# Altium project PCB_Design.PrjPcb
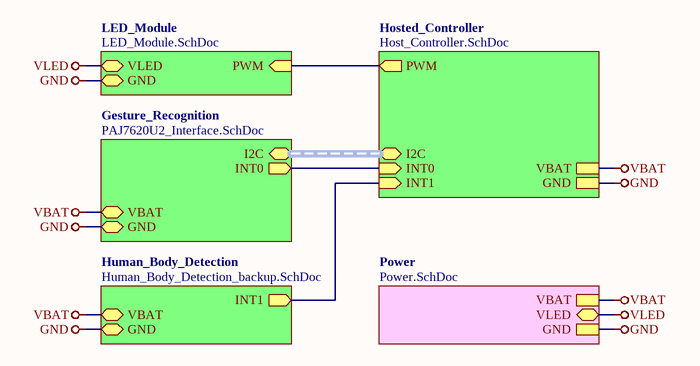
[diagram p0: Main.SchDoc]
12 sheets, 32 parts. Net scope: hierarchical (ports join the sheet entries above them; power ports are global).
Board files: test.PcbDoc, Board.PcbDoc, PCB_of_Aultimation.PcbDoc, PCB1.PcbDoc
Sheets:
  Main.SchDoc
    Power = Power.SchDoc
    Hosted_Controller = Host_Controller.SchDoc
      Oscillator = Oscillator_11.0592MHz_Using_HC49S.SchDoc
      Reset = Reset_With_Power_On.SchDoc
      Microcontroller_STC12C5A60S2 = Microcontroller_STC12C5A60S2.SchDoc
    LED_Module = LED_Module.SchDoc
      Amplifier = IRF530N_MOS_Amplifier.SchDoc
      LED = LED_Port.SchDoc
    Gesture_Recognition = PAJ7620U2_Interface.SchDoc
    Human_Body_Detection = Human_Body_Detection_backup.SchDoc
      Level_Switch = Level_Switch_by_9013.SchDoc

## Sheet Main.SchDoc: Main
size A4

### Sub-sheets
Gesture_Recognition = PAJ7620U2_Interface.SchDoc: VBAT, GND, INT0 (out), I2C (harness I2C)
Hosted_Controller = Host_Controller.SchDoc: VBAT, GND, PWM (out), I2C (harness I2C), INT0 (in), INT1 (in)
Human_Body_Detection = Human_Body_Detection_backup.SchDoc: INT1 (out), VBAT, GND
LED_Module = LED_Module.SchDoc: PWM (in), VLED, GND
Power = Power.SchDoc: VBAT, GND, VLED

### Nets
GND: sheet Power/GND, sheet Hosted_Controller/GND, sheet LED_Module/GND, sheet Gesture_Recognition/GND, sheet Human_Body_Detection/GND
PWM: sheet Hosted_Controller/PWM, sheet LED_Module/PWM
VBAT: sheet Power/VBAT, sheet Power/VLED, sheet Hosted_Controller/VBAT, sheet LED_Module/VLED, sheet Gesture_Recognition/VBAT, sheet Human_Body_Detection/VBAT  [also labelled VLED]  [project net PWM_VCC]
INT0: sheet Hosted_Controller/INT0, sheet Gesture_Recognition/INT0
INT1: sheet Hosted_Controller/INT1, sheet Human_Body_Detection/INT1

### Buses and harness runs
harness sheet Gesture_Recognition/I2C = sheet Hosted_Controller/I2C

## Sheet Power.SchDoc: Power
size A4
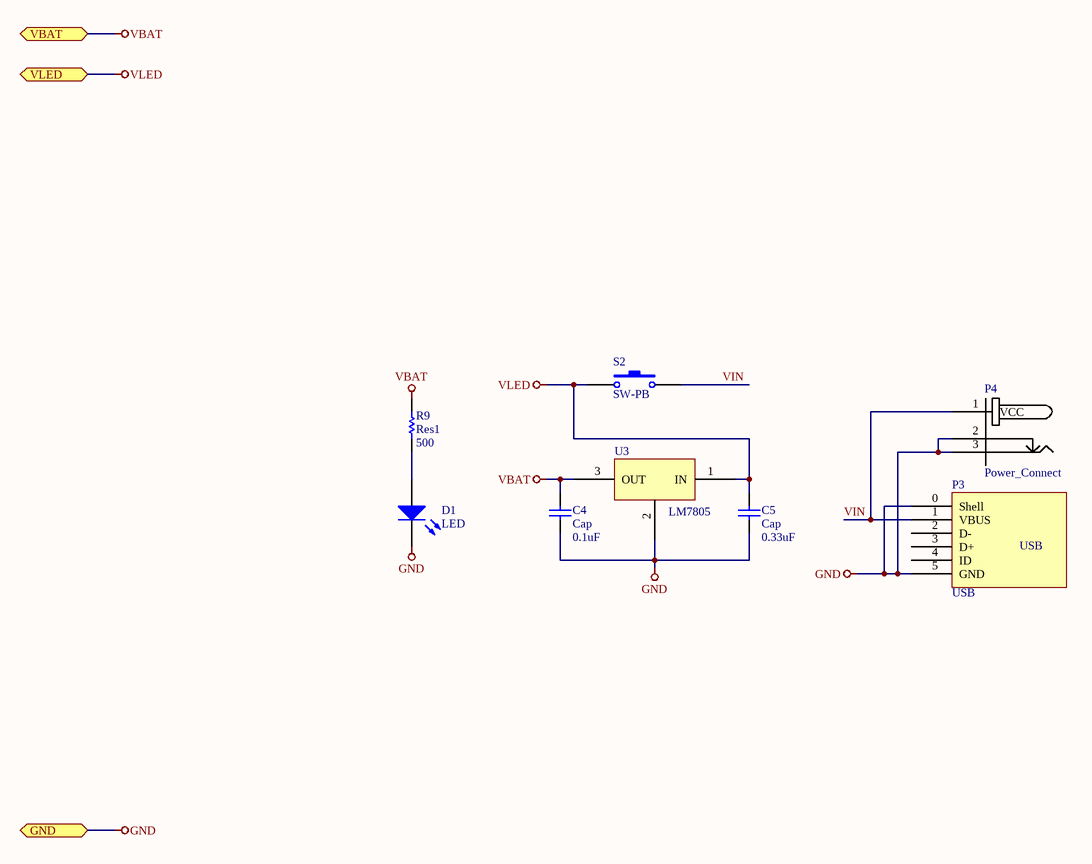
[diagram p1: Power.SchDoc]

### Parts
C4  Cap  value 0.1uF  [C0805]
C5  Cap  value 0.33uF  [C0805]
D1  LED  [L0805R]
P3  USB  [USB-MINI]
P4  Power_Connect  [DC_002]
R9  Res1  value 500  [R0805]
S2  SW-PB  [SW7X7]
U3  LM7805  [TO-263]

### Ports
GND, VBAT, VLED

### Nets
GND: C4.1 C5.1 D1.2(K) P3.0(Shell) P3.5(GND) P4.2(TAP) P4.3(GND) U3.2(GND) ; port GND
VBAT: C4.2 C5.2 R9.2 S2.1 U3.1(IN) U3.3(OUT) ; port VBAT, port VLED  [also labelled VLED]  [project net PWM_VCC]
VIN: P3.1(VBUS) P4.1(VCC) S2.2
NetD1_1: D1.1(A) R9.1

Not connected (* = marked no-connect by the designer): P3 2(D-) 3(D+) 4(ID)

### Library data of the parts
C4 C5 = Cap: Non-Polar Capacitor
D1 = LED: Typical INFRARED GaAs LED; Published: 8-Jun-2000; LatestRevisionDate: 08-Jul-2005; LatestRevisionNote: Mech Layer 1 removed.; PackageReference: LED-0; Publisher: Altium Limited; PackageDescription: LED; 2 Leads
P3 = USBPort
P4 = Power: pin to pad: 1>2 2>3 3>1
R9 = Res1: Resistor
S2 = SW-PB: Switch

## Sheet Host_Controller.SchDoc: Host_Controller
size A4
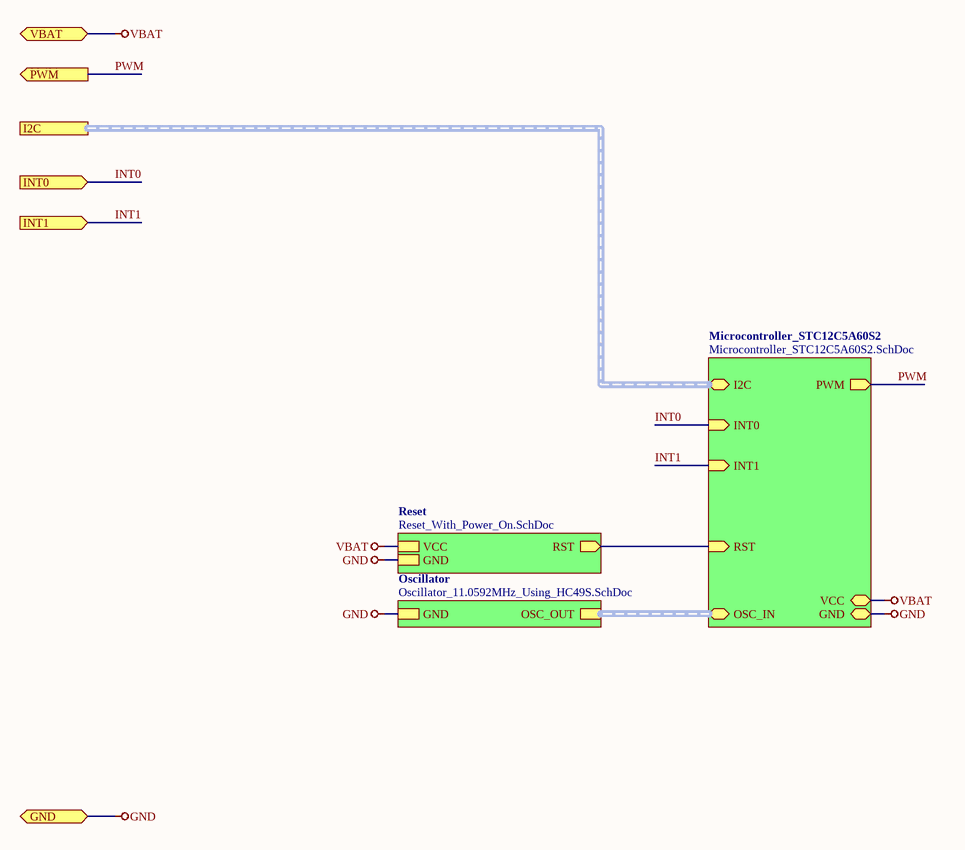
[diagram p2: Host_Controller.SchDoc]

### Sub-sheets
Microcontroller_STC12C5A60S2 = Microcontroller_STC12C5A60S2.SchDoc: OSC_IN (harness CLOCK), RST (in), VCC, GND, PWM (out), I2C (harness I2C), INT0 (in), INT1 (in)
Oscillator = Oscillator_11.0592MHz_Using_HC49S.SchDoc: GND, OSC_OUT (harness OSC)
Reset = Reset_With_Power_On.SchDoc: VCC, GND, RST (out)

### Ports
GND, I2C (harness I2C), INT0 (in), INT1 (in), PWM (out), VBAT

### Nets
GND: port GND, sheet Oscillator/GND, sheet Reset/GND, sheet Microcontroller_STC12C5A60S2/GND
PWM: port PWM, sheet Microcontroller_STC12C5A60S2/PWM
VBAT: port VBAT, sheet Reset/VCC, sheet Microcontroller_STC12C5A60S2/VCC  [project net PWM_VCC]
INT0: port INT0, sheet Microcontroller_STC12C5A60S2/INT0
INT1: port INT1, sheet Microcontroller_STC12C5A60S2/INT1
RST: sheet Reset/RST, sheet Microcontroller_STC12C5A60S2/RST

### Buses and harness runs
harness port I2C = sheet Microcontroller_STC12C5A60S2/I2C
harness sheet Microcontroller_STC12C5A60S2/OSC_IN = sheet Oscillator/OSC_OUT

## Sheet Oscillator_11.0592MHz_Using_HC49S.SchDoc: Oscillator_11.0592MHz_Using_HC49S
size A4
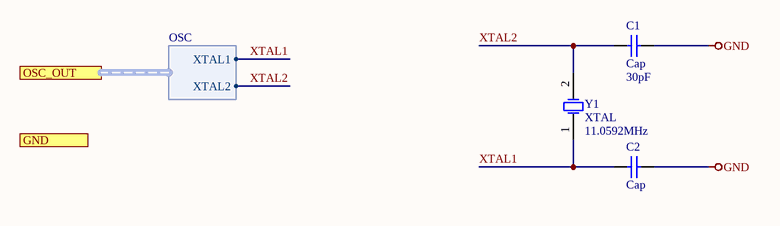
[diagram p3: Oscillator_11.0592MHz_Using_HC49S.SchDoc]

### Parts
C1  Cap  value 30pF  [C0805]
C2  Cap  [C0805]
Y1  XTAL  OscillationFrequency: 11.0592MHz  [XTAL-HC49S-SMD]

### Ports
GND, OSC_OUT (harness OSC)

### Harnesses
OSC: XTAL1, XTAL2

### Nets
GND: C1.2 C2.2 ; port GND
XTAL1: C2.1 Y1.1(OSC1) ; port OSC_OUT.XTAL1
XTAL2: C1.1 Y1.2(OSC2) ; port OSC_OUT.XTAL2

### Library data of the parts
C1 C2 = Cap: Non-Polar Capacitor
Y1 = XTAL_1: Crystal Oscillator

## Sheet Reset_With_Power_On.SchDoc: Reset_With_Power_On
size A4
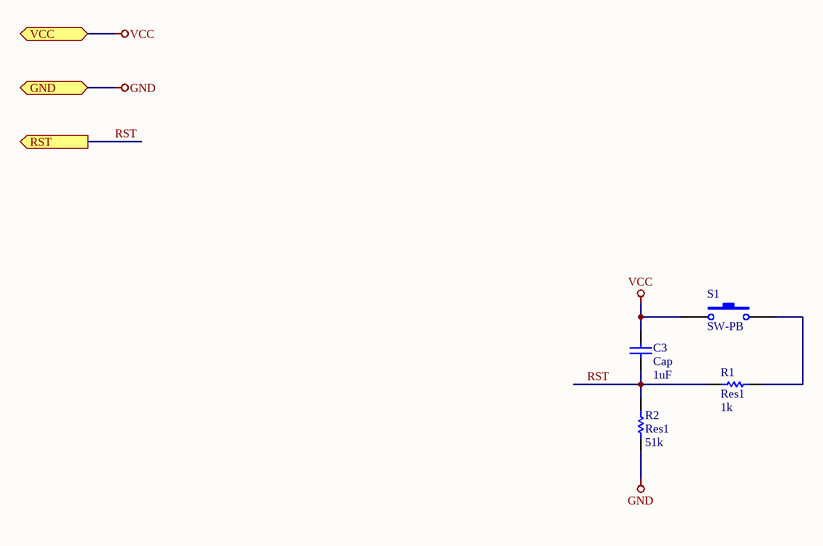
[diagram p4: Reset_With_Power_On.SchDoc]

### Parts
C3  Cap  value 1uF  [C0805]
R1  Res1  value 1k  [R0805]
R2  Res1  value 51k  [R0805]
S1  SW-PB  [KEY-DIP4]

### Ports
GND, RST (out), VCC

### Nets
GND: R2.1 ; port GND
VCC: C3.1 S1.1 ; port VCC  [project net PWM_VCC]
RST: C3.2 R1.1 R2.2 ; port RST
NetR1_2: R1.2 S1.2

### Library data of the parts
C3 = Cap: Non-Polar Capacitor
R1 R2 = Res1: Resistor
S1 = SW-PB: Switch

## Sheet Microcontroller_STC12C5A60S2.SchDoc: Microcontroller_STC12C5A60S2
size A4
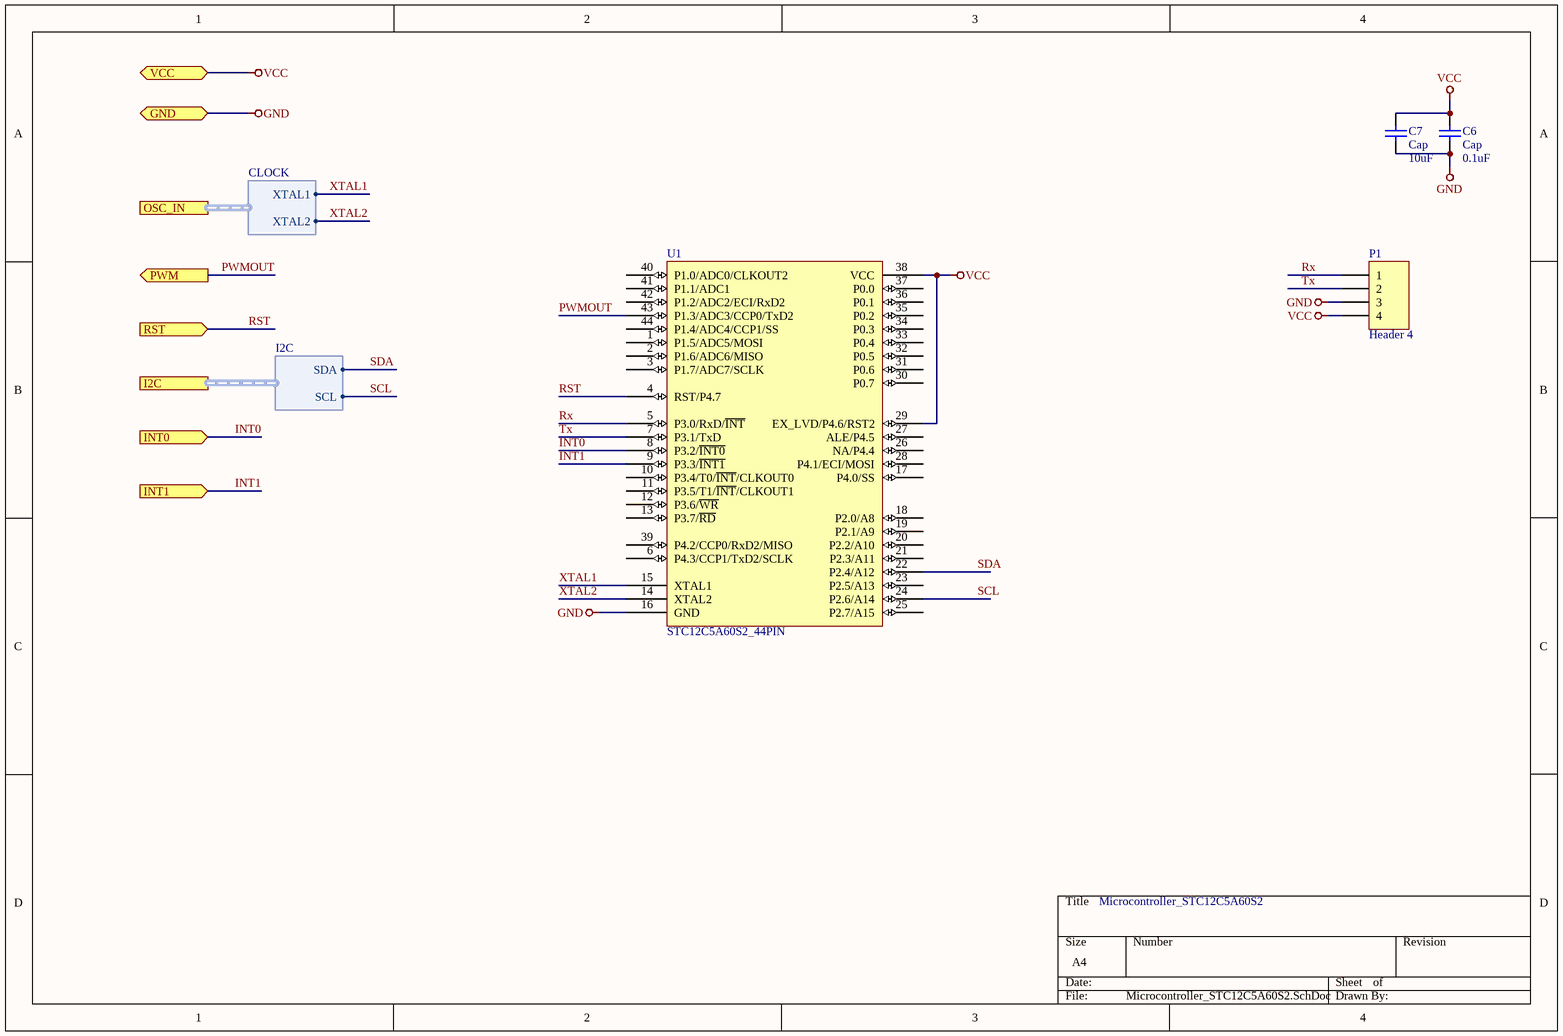
[diagram p5: Microcontroller_STC12C5A60S2.SchDoc]

### Parts
C6  Cap  value 0.1uF  [C0805]
C7  Cap  value 10uF  [1206C]
P1  Header 4  [HDR1X4HA]
U1  STC12C5A60S2_44PIN  [STC12C5A60S2_44PIN]

### Ports
GND, I2C (harness I2C), INT0 (in), INT1 (in), OSC_IN (harness CLOCK), PWM (out), RST (in), VCC

### Harnesses
CLOCK: XTAL1, XTAL2
I2C: SDA, SCL

### Nets
GND: C6.1 C7.1 P1.3 U1.16(GND) ; port GND
PWMOUT: U1.43(P1.3/ADC3/CCP0/TxD2) ; port PWM  [project net PWM]
VCC: C6.2 C7.2 P1.4 U1.29(EX_LVD/P4.6/RST2) U1.38(VCC) ; port VCC  [project net PWM_VCC]
INT0: U1.8(P3.2/~{INT0}) ; port INT0
INT1: U1.9(P3.3/~{INT1}) ; port INT1
RST: U1.4(RST/P4.7) ; port RST
Rx: P1.1 U1.5(P3.0/RxD/~{INT})
SCL: U1.24(P2.6/A14) ; port I2C.SCL
SDA: U1.22(P2.4/A12) ; port I2C.SDA
Tx: P1.2 U1.7(P3.1/TxD)
XTAL1: U1.15(XTAL1) ; port OSC_IN.XTAL1
XTAL2: U1.14(XTAL2) ; port OSC_IN.XTAL2

Not connected (* = marked no-connect by the designer): U1 1(P1.5/ADC5/MOSI) 2(P1.6/ADC6/MISO) 3(P1.7/ADC7/SCLK) 6(P4.3/CCP1/TxD2/SCLK) 10(P3.4/T0/~{INT}/CLKOUT0) 11(P3.5/T1/~{INT}/CLKOUT1) 12(P3.6/~{WR}) 13(P3.7/~{RD}) 17(P4.0/SS) 18(P2.0/A8) 19(P2.1/A9) 20(P2.2/A10) 21(P2.3/A11) 23(P2.5/A13) 25(P2.7/A15) 26(NA/P4.4) 27(ALE/P4.5) 28(P4.1/ECI/MOSI) 30(P0.7) 31(P0.6) 32(P0.5) 33(P0.4) 34(P0.3) 35(P0.2) 36(P0.1) 37(P0.0) 39(P4.2/CCP0/RxD2/MISO) 40(P1.0/ADC0/CLKOUT2) 41(P1.1/ADC1) 42(P1.2/ADC2/ECI/RxD2) 44(P1.4/ADC4/CCP1/SS)

### Library data of the parts
C6 C7 = Cap: Non-Polar Capacitor
P1 = Header 4: Header, 4-Pin; LatestRevisionDate: 17-Jul-2002; LatestRevisionNote: Re-released for DXP Platform.; Publisher: Altium Limited
U1 = STC12C5A60S2_44PIN: MCU

## Sheet LED_Module.SchDoc: LED_Module
size A4
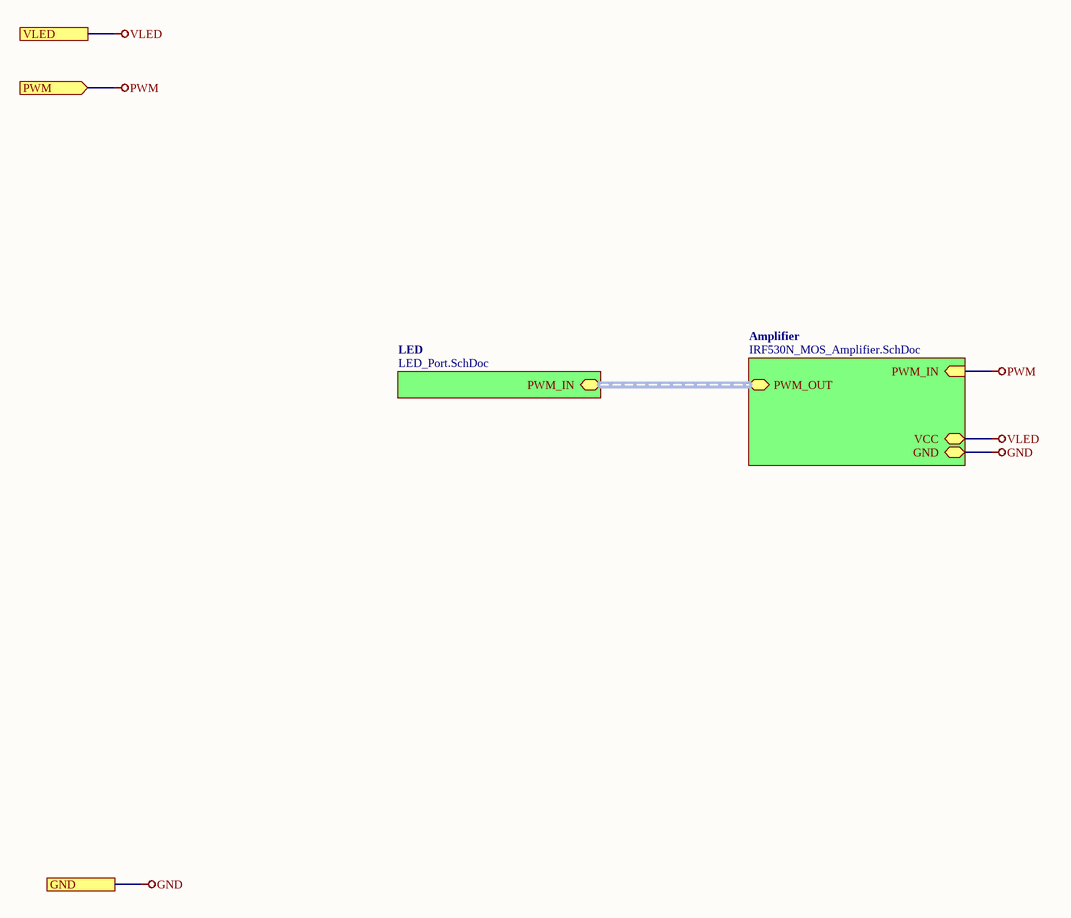
[diagram p6: LED_Module.SchDoc]

### Sub-sheets
Amplifier = IRF530N_MOS_Amplifier.SchDoc: GND, VCC, PWM_IN (in), PWM_OUT (harness PWM_LIGHT)
LED = LED_Port.SchDoc: PWM_IN (harness PWM_LIGHT)

### Ports
GND, PWM (in), VLED

### Nets
GND: port GND, sheet Amplifier/GND
PWM: port PWM, sheet Amplifier/PWM_IN
VLED: port VLED, sheet Amplifier/VCC  [project net PWM_VCC]

### Buses and harness runs
harness sheet Amplifier/PWM_OUT = sheet LED/PWM_IN

## Sheet IRF530N_MOS_Amplifier.SchDoc: IRF530N_MOS_Amplifier
size A4
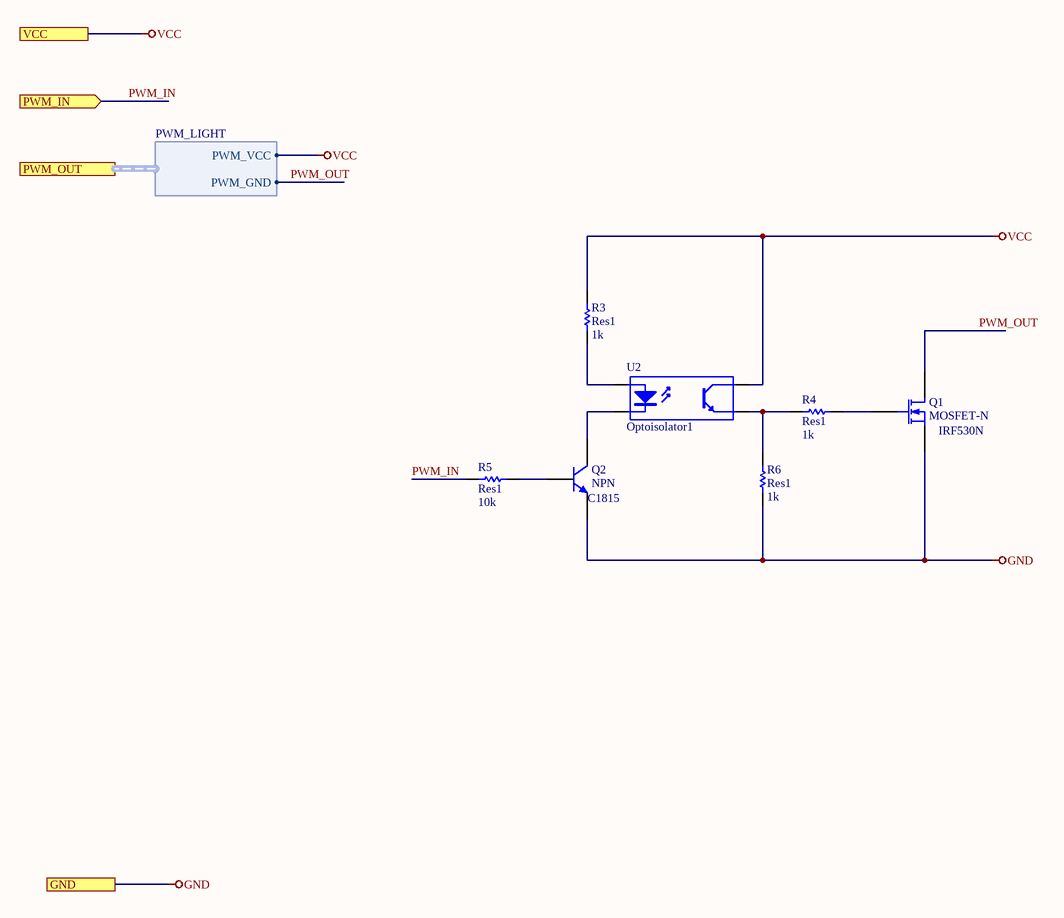
[diagram p7: IRF530N_MOS_Amplifier.SchDoc]

### Parts
Q1  MOSFET-N  name: IRF530N  [TO-263]
Q2  NPN  name: C1815  [SOT-23]
R3  Res1  value 1k  [R0805]
R4  Res1  value 1k  [R0805]
R5  Res1  value 10k  [R0805]
R6  Res1  value 1k  [R0805]
U2  Optoisolator1  [DIP_4]

### Ports
GND, PWM_IN (in), PWM_OUT (harness PWM_LIGHT), VCC

### Harnesses
PWM_LIGHT: PWM_VCC, PWM_GND

### Nets
GND: Q1.3(S) Q2.3(E) R6.1 ; port GND
PWM_IN: R5.1 ; port PWM_IN  [project net PWM]
VCC: R3.2 U2.4(C) ; port VCC, port PWM_OUT.PWM_VCC  [project net PWM_VCC]
PWM_OUT: Q1.2(D) ; port PWM_OUT.PWM_GND  [project net PWM_GND]
NetQ1_1: Q1.1(G) R4.1
NetQ2_1: Q2.1(C) U2.2(K)
NetQ2_2: Q2.2(B) R5.2
NetR3_1: R3.1 U2.1(A)
NetR4_2: R4.2 R6.2 U2.3(E)

### Library data of the parts
Q1 = MOSFET-N: N-Channel MOSFET; Published: 8-Jun-2000; LatestRevisionDate: 17-Jul-2002; LatestRevisionNote: Re-released for DXP Platform.; PackageVersion: 1995/1996; PackageReference: E3; Publisher: Altium Limited; PackageDescription: TO, Flat Index; 3 In-Line, Axial Leads; Body Dia. 4.6mm; Lead Dia. 0.5 mm (max)
Q2 = NPN: NPN Bipolar Transistor; pin to pad: 1>3 2>1 3>2; PackageReference: TO-226-AA; PackageDescription: TO, Flat Index; 3 In-Line, Axial Leads; Body Dia. 4.8mm; Leads 0.55 x 0.51 mm (max); Code_JEDEC: TO-226-AA; Published: 8-Jun-2000; LatestRevisionDate: 17-Jul-2002; LatestRevisionNote: Re-released for DXP Platform.; Publisher: Altium Limited
R3-R6 = Res1: Resistor
U2 = Optoisolator1: 4-Pin Phototransistor Optocoupler; Published: 24-Mar-1999; LatestRevisionDate: 04-Mar-2005; LatestRevisionNote: Sch pins 3 & 4 Swapped.; DatasheetVersion: Nov-2003; PackageReference: DIP-4; Publisher: Altium Limited

## Sheet LED_Port.SchDoc: LED_Port
size A4
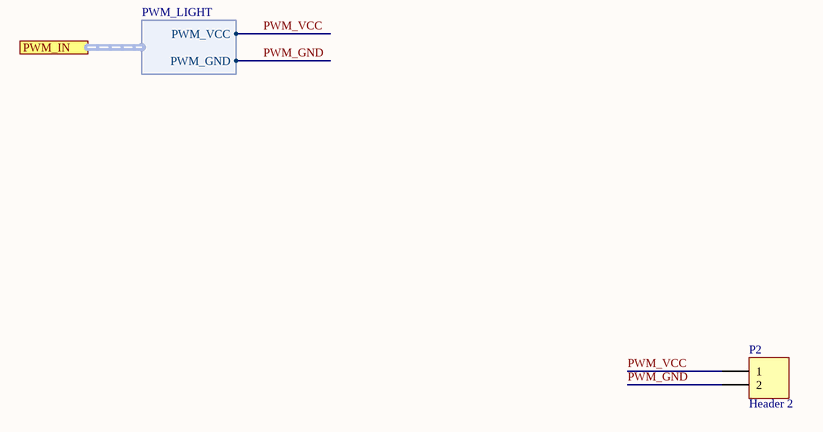
[diagram p8: LED_Port.SchDoc]

### Parts
P2  Header 2  [CCM-5.08-2P]

### Ports
PWM_IN (harness PWM_LIGHT)

### Harnesses
PWM_LIGHT: PWM_VCC, PWM_GND

### Nets
PWM_VCC: P2.1 ; port PWM_IN.PWM_VCC
PWM_GND: P2.2 ; port PWM_IN.PWM_GND

### Library data of the parts
P2 = Header 2: Header, 2-Pin; LatestRevisionDate: 17-Jul-2002; LatestRevisionNote: Re-released for DXP Platform.; Publisher: Altium Limited

## Sheet PAJ7620U2_Interface.SchDoc: PAJ7620U2_Interface
size A4
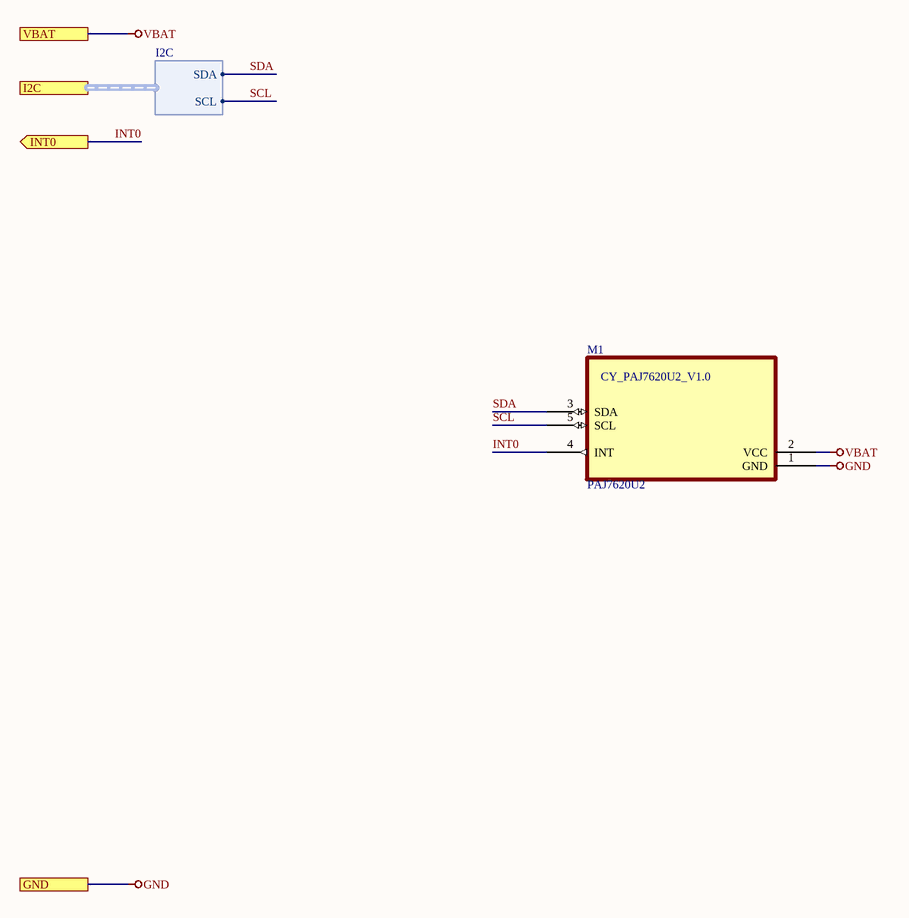
[diagram p9: PAJ7620U2_Interface.SchDoc]

### Parts
M1  PAJ7620U2  [PAJ7620U2_Interface]

### Ports
GND, I2C (harness I2C), INT0 (out), VBAT

### Harnesses
I2C: SDA, SCL

### Nets
GND: M1.1(GND) ; port GND
VBAT: M1.2(VCC) ; port VBAT  [project net PWM_VCC]
INT0: M1.4(INT) ; port INT0
SCL: M1.5(SCL) ; port I2C.SCL
SDA: M1.3(SDA) ; port I2C.SDA

### Notes on the sheet
- (in symbol PAJ7620U2_Interface) CY_PAJ7620U2_V1.0

### Library data of the parts
M1 = PAJ7620U2_Interface

## Sheet Human_Body_Detection_backup.SchDoc: Human_Body_Detection_Interface
size A4
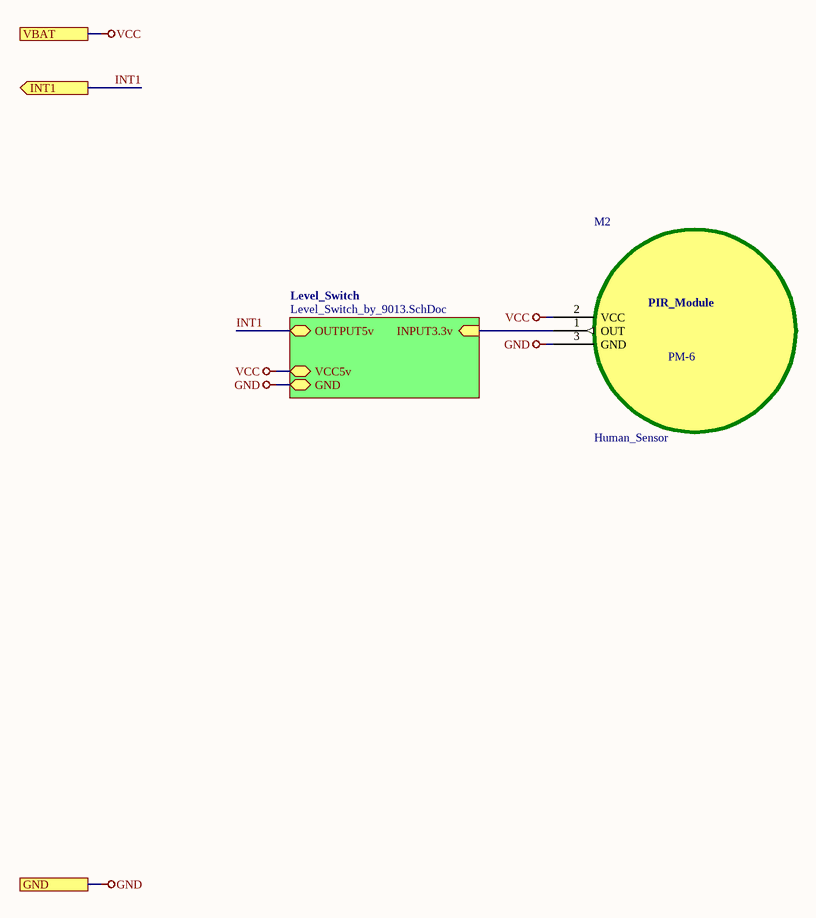
[diagram p10: Human_Body_Detection_backup.SchDoc]

### Parts
M2  Human_Sensor  [PM-6]

### Sub-sheets
Level_Switch = Level_Switch_by_9013.SchDoc: VCC5v, GND, OUTPUT5v, INPUT3.3v (in)

### Ports
GND, INT1 (out), VBAT

### Nets
GND: M2.3(GND) ; port GND, sheet Level_Switch/GND
VCC: M2.2(VCC) ; port VBAT, sheet Level_Switch/VCC5v  [project net PWM_VCC]
INT1: port INT1, sheet Level_Switch/OUTPUT5v
NetM2_1: M2.1(OUT) ; sheet Level_Switch/INPUT3.3v

### Notes on the sheet
- (in symbol Human_Sensor) PIR_Module; PM-6

## Sheet Level_Switch_by_9013.SchDoc: Level_Switch_by_9013
size A4
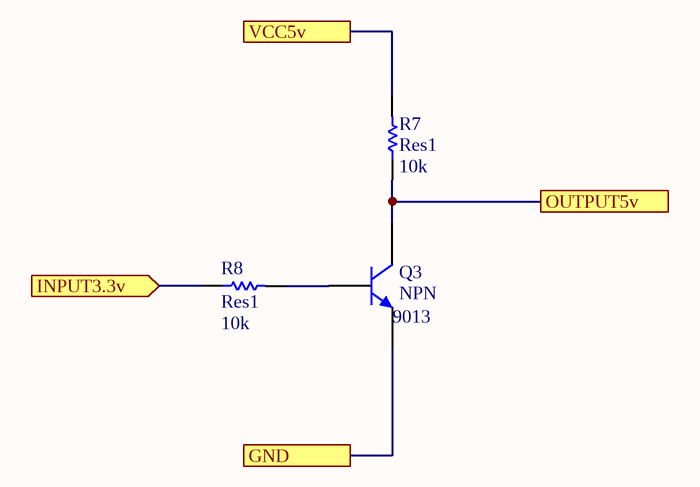
[diagram p11: Level_Switch_by_9013.SchDoc]

### Parts
Q3  NPN  name: 9013  [SOT-23]
R7  Res1  value 10k  [R0805]
R8  Res1  value 10k  [R0805]

### Ports
GND, INPUT3.3v (in), OUTPUT5v, VCC5v

### Nets
GND: Q3.3(E) ; port GND
PWM_VCC: R7.2 ; port VCC5v
INT1: Q3.1(C) R7.1 ; port OUTPUT5v
NetM2_1: R8.1 ; port INPUT3.3v
NetQ3_2: Q3.2(B) R8.2

### Library data of the parts
Q3 = NPN: NPN Bipolar Transistor; pin to pad: 1>3 2>1 3>2; Published: 8-Jun-2000; LatestRevisionDate: 17-Jul-2002; LatestRevisionNote: Re-released for DXP Platform.; PackageReference: TO-226-AA; Publisher: Altium Limited; PackageDescription: TO, Flat Index; 3 In-Line, Axial Leads; Body Dia. 4.8mm; Leads 0.55 x 0.51 mm (max); Code_JEDEC: TO-226-AA
R7 R8 = Res1: Resistor

## Nets that join several sheets
GND: Power (8 pins), Oscillator_11.0592MHz_Using_HC49S (C1.2 C2.2), Reset_With_Power_On (R2.1), Microcontroller_STC12C5A60S2 (C6.1 C7.1 P1.3 U1.16), IRF530N_MOS_Amplifier (Q1.3 Q2.3 R6.1), PAJ7620U2_Interface (M1.1), Human_Body_Detection_backup (M2.3), Level_Switch_by_9013 (Q3.3)
PWM: Microcontroller_STC12C5A60S2 (U1.43), IRF530N_MOS_Amplifier (R5.1)
PWM_VCC: Power (6 pins), Reset_With_Power_On (C3.1 S1.1), Microcontroller_STC12C5A60S2 (5 pins), IRF530N_MOS_Amplifier (R3.2 U2.4), LED_Port (P2.1), PAJ7620U2_Interface (M1.2), Human_Body_Detection_backup (M2.2), Level_Switch_by_9013 (R7.2)
INT0: Microcontroller_STC12C5A60S2 (U1.8), PAJ7620U2_Interface (M1.4)
INT1: Microcontroller_STC12C5A60S2 (U1.9), Level_Switch_by_9013 (Q3.1 R7.1)
NetM2_1: Human_Body_Detection_backup (M2.1), Level_Switch_by_9013 (R8.1)
PWM_GND: IRF530N_MOS_Amplifier (Q1.2), LED_Port (P2.2)
RST: Reset_With_Power_On (C3.2 R1.1 R2.2), Microcontroller_STC12C5A60S2 (U1.4)
SCL: Microcontroller_STC12C5A60S2 (U1.24), PAJ7620U2_Interface (M1.5)
SDA: Microcontroller_STC12C5A60S2 (U1.22), PAJ7620U2_Interface (M1.3)
XTAL1: Oscillator_11.0592MHz_Using_HC49S (C2.1 Y1.1), Microcontroller_STC12C5A60S2 (U1.15)
XTAL2: Oscillator_11.0592MHz_Using_HC49S (C1.1 Y1.2), Microcontroller_STC12C5A60S2 (U1.14)